# EAGLE design BabyMonitorBuzzer (EAGLE 6.4)
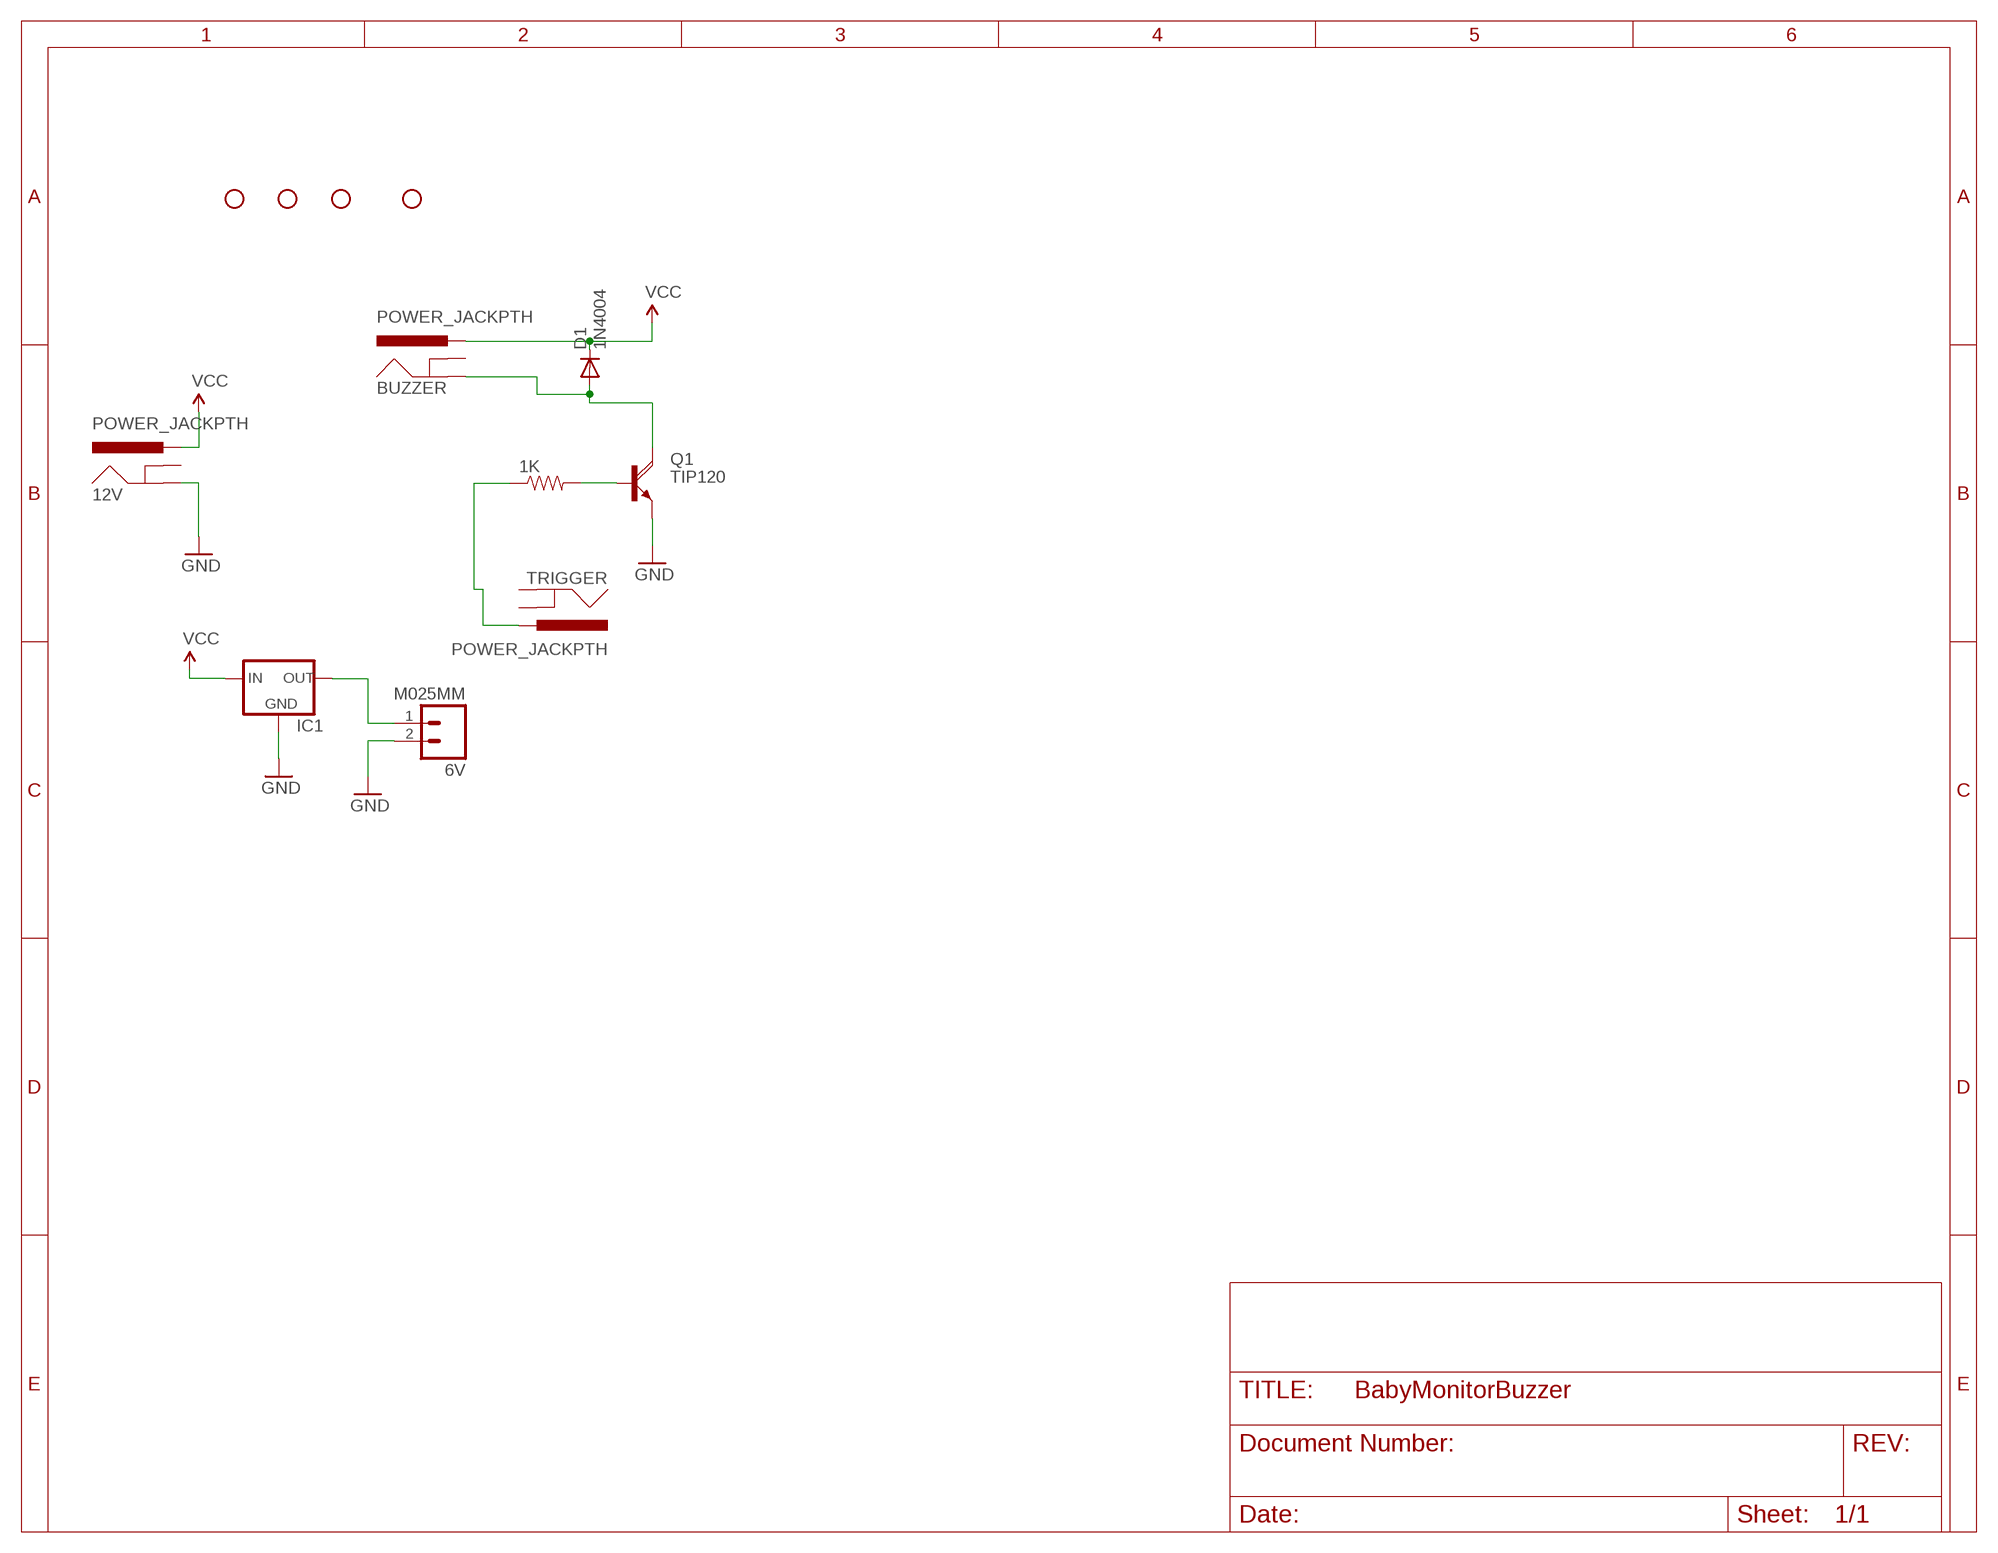
[diagram p0: schematic, sheet 1]

## Parts
1K  RESISTORAXIAL-0.3  [AXIAL-0.3]
6V  M025MM  [SCREWTERMINAL-5MM-2]
12V  POWER_JACKPTH  [POWER_JACK_PTH]
BUZZER  POWER_JACKPTH  [POWER_JACK_PTH]
D1  1N4004  [DO41-10]
IC1  78XXL  [78XXL]
Q1  TIP120  [TO220AH]
STANDOFF1  STAND-OFF  [STAND-OFF]
STANDOFF2  STAND-OFF  [STAND-OFF]
STANDOFF3  STAND-OFF  [STAND-OFF]
STANDOFF4  STAND-OFF  [STAND-OFF]
TRIGGER  POWER_JACKPTH  [POWER_JACK_PTH]

## Nets
GND: 6V.2 12V.GND IC1.GND Q1.E
N$1: 1K.P$2 Q1.B
N$2: BUZZER.GND D1.A Q1.C
N$3: 1K.P$1 TRIGGER.PWR
N$4: 6V.1 IC1.OUT
VCC: 12V.PWR BUZZER.PWR D1.C IC1.IN
Unconnected: 12V.GNDBREAK BUZZER.GNDBREAK TRIGGER.GND TRIGGER.GNDBREAK

## Library data of the parts
1K = SparkFun-Passives:RESISTOR: Resistor Basic schematic elements and footprints for 0603, 1206, and PTH resistors.
6V = SparkFun-Connectors:M02: Standard 2-pin 0.1" header. Use with - straight break away headers ( PRT-00116) - right angle break away headers (PRT-00553) - swiss pins (PRT-00743) - machine pins (PRT-00117) - female headers (PRT-00115) Molex polarized connector foot print use with: PRT-08233 with associated crimp pins and housings. 2.54_SCREWTERM for use with PRT-10571. 3.5mm Screw Terminal footprints for PRT-08084 5mm Screw Terminal footprints for use with PRT-08433
12V BUZZER TRIGGER = SparkFun-Connectors:POWER_JACK: Power Jack This is the standard 5.5mm barrel jack for power. The PTH is the most common, proven, reliable, footprint. The Slot footprint only works if the mill layer is transmitted to the PCB fab house so be warned. Spark Fun Electronics SKU : PRT-00119 SMT: CONN-08106 Mating wall wart : TOL-00298 (and others)
D1 = diode:1N4004: DIODE general purpose rectifier, 1 A
IC1 = v-reg:78XXL: VOLTAGE REGULATOR
Q1 = transistor-power:TIP120: NPN DARLINGTON TRANSISTOR
STANDOFF1-STANDOFF4 = SparkFun-Electromechanical:STAND-OFF: #4 Stand Off This is the mechanical footprint for a #4 phillips button head screw. Use the keepout ring to avoid running the screw head into surrounding components. SKU : PRT-00447

## Board
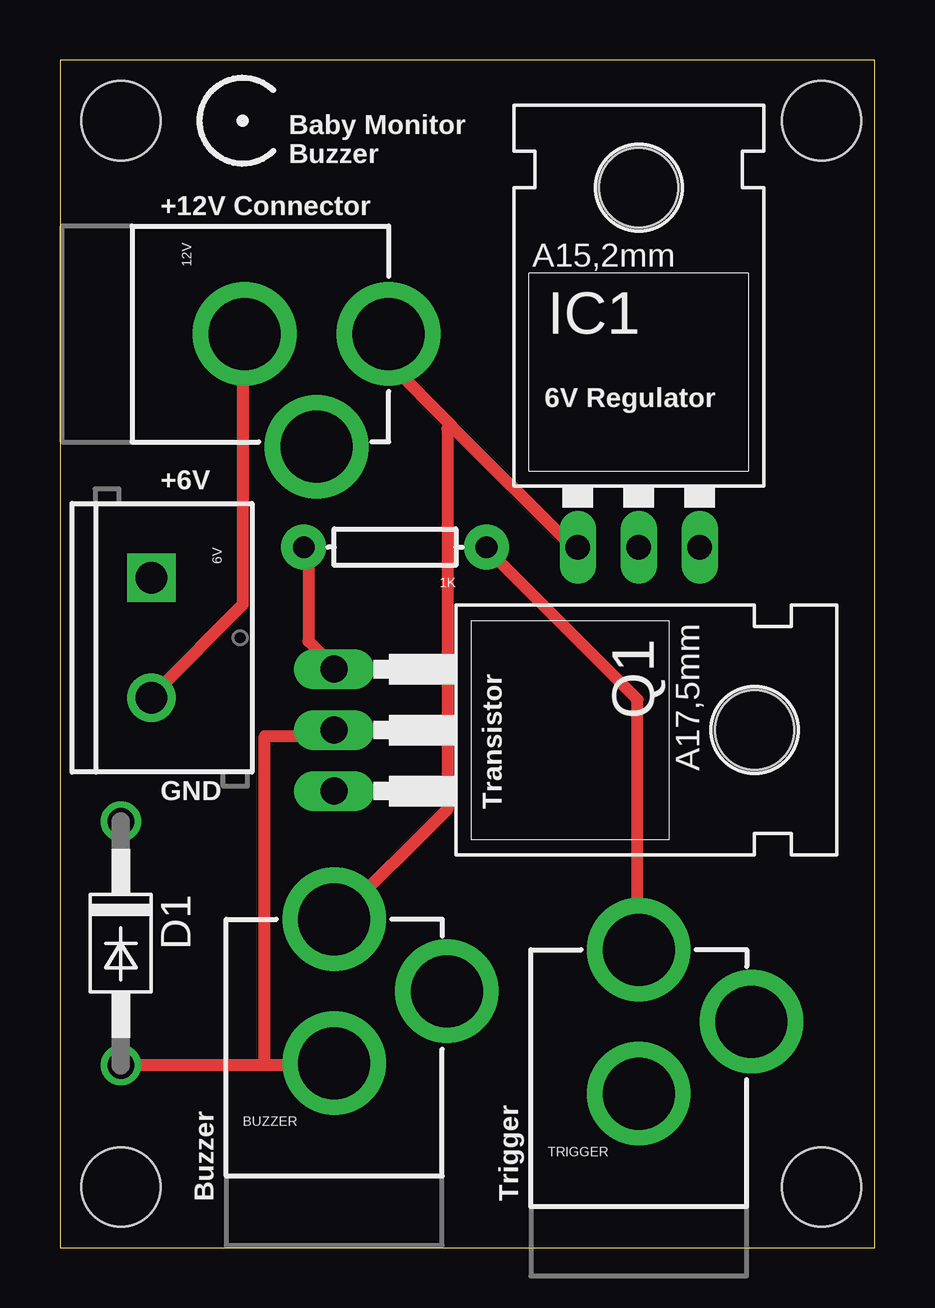
[diagram p1: board, top side]
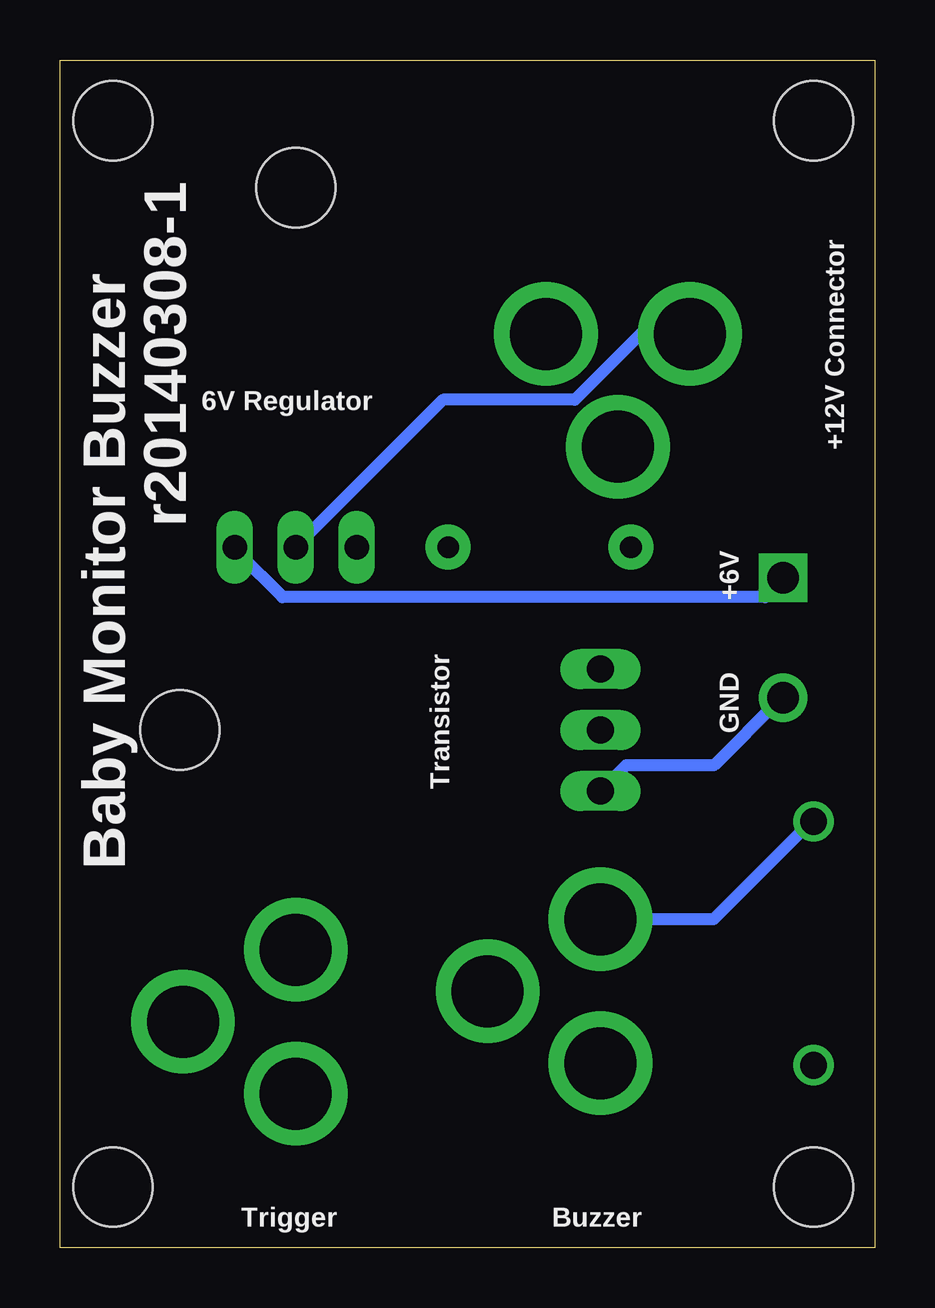
[diagram p2: board, bottom side, seen from below]

Size 33.96 x 49.52 mm. Coordinates in mm from the lower left corner, seen from the top.
Outline: 0,0 33.96,0 33.96,49.52 0,49.52 0,0
Copper layers (1*16): Top 0.035mm / dielectric 1.5mm / Bottom 0.035mm
Design rules "default *": minimum track width 20mil, minimum drill 24mil, track to track 8mil, track to pad 8mil, pad to pad 8mil, via to via 8mil, smd to smd 8mil, copper to edge 40mil, drill to drill 8mil, minimum pad ring 10mil, minimum via ring 8mil, stop-mask expansion 0mil, vias tented up to drill 0mil, thermal gap 10mil

### Footprints (pad centres in the part's own frame; a part is rotated, then mirrored left to right if it is on the bottom)
AXIAL-0.3 = drill 0.9 pad 1.88: P$1 -3.81,0; P$2 3.81,0
SCREWTERMINAL-5MM-2 = drill 1.3 pad 2.032 square: 1 0,0 | drill 1.3 pad 2.032: 2 5,0
POWER_JACK_PTH = drill 2.997 pad 4.318: GND 0,7.7; GNDBREAK 4.7,10.7; PWR 0,13.7
DO41-10 = drill 1.118: A 5.08,0; C -5.08,0
78XXL = drill 1.016 long: GND 0,-3.81; IN -2.54,-3.81; OUT 2.54,-3.81 | hole 3.302: 0,11.176
TO220AH = drill 1.118 long: B -2.54,-6.35; C 0,-6.35; E 2.54,-6.35 | hole 3.302: 0,11.176
STAND-OFF = hole 3.302: 0,0

### Placement (x,y rotation side)
1K  13.97,29.21 180 top
6V  3.81,27.94 270 top
12V  0,38.1 270 top
BUZZER  11.43,0 0 top
D1  2.54,12.7 270 top
IC1  24.13,33.02 0 top
Q1  17.78,21.59 270 top
STANDOFF1  2.54,2.54 0 top
STANDOFF2  31.75,2.54 0 top
STANDOFF3  2.54,46.99 0 top
STANDOFF4  31.75,46.99 0 top
TRIGGER  24.13,-1.27 0 top

### Tracks (layer width: path | path; a pad name or v marks a point on that pad's centre or on a via)
GND
  Top 0.508: 6V.2 3.96,23.16 7.62,26.82 7.62,38.1 12V.GND
  Bottom 0.508: Q1.E 10.36,20.12 6.71,20.12 3.96,22.86 6V.2 | IC1.GND 17.98,35.36 12.5,35.36 9.75,38.1 12V.GND
N$1
  Top 0.508: Q1.B 11.28,24.38 10.36,25.3 10.36,28.96 1K.P$2
N$2
  Top 0.508: 8.53,7.62 11.28,7.62 BUZZER.GND | 8.53,7.62 D1.A | 8.53,7.62 8.53,21.34 11.28,21.34 Q1.C
N$3
  Top 0.508: 1K.P$1 17.98,28.96 24.08,22.86 24.08,12.5 TRIGGER.PWR
N$4
  Bottom 0.508: IC1.OUT 26.52,28.96 24.69,27.13 4.57,27.13 3.96,27.74 6V.1
VCC
  Top 0.508: 16.31,34.29 13.72,36.88 13.72,38.1 12V.PWR | 16.31,34.29 21.34,29.26 IC1.IN | BUZZER.PWR 11.58,13.72 16.15,18.29 16.15,34.14 16.31,34.29
  Bottom 0.508: D1.C 2.74,17.68 6.71,13.72 11.28,13.72 BUZZER.PWR

### Text on the board
tPlace: Baby Monitor / Buzzer | +12V Connector | 6V Regulator | +6V | GND | Transistor | Buzzer | Trigger
bPlace: r20140308-1 | Baby Monitor Buzzer | 6V Regulator | +12V Connector | +6V | Transistor | GND | Buzzer | Trigger